# Altium project calorieScale_Project.PrjPcb
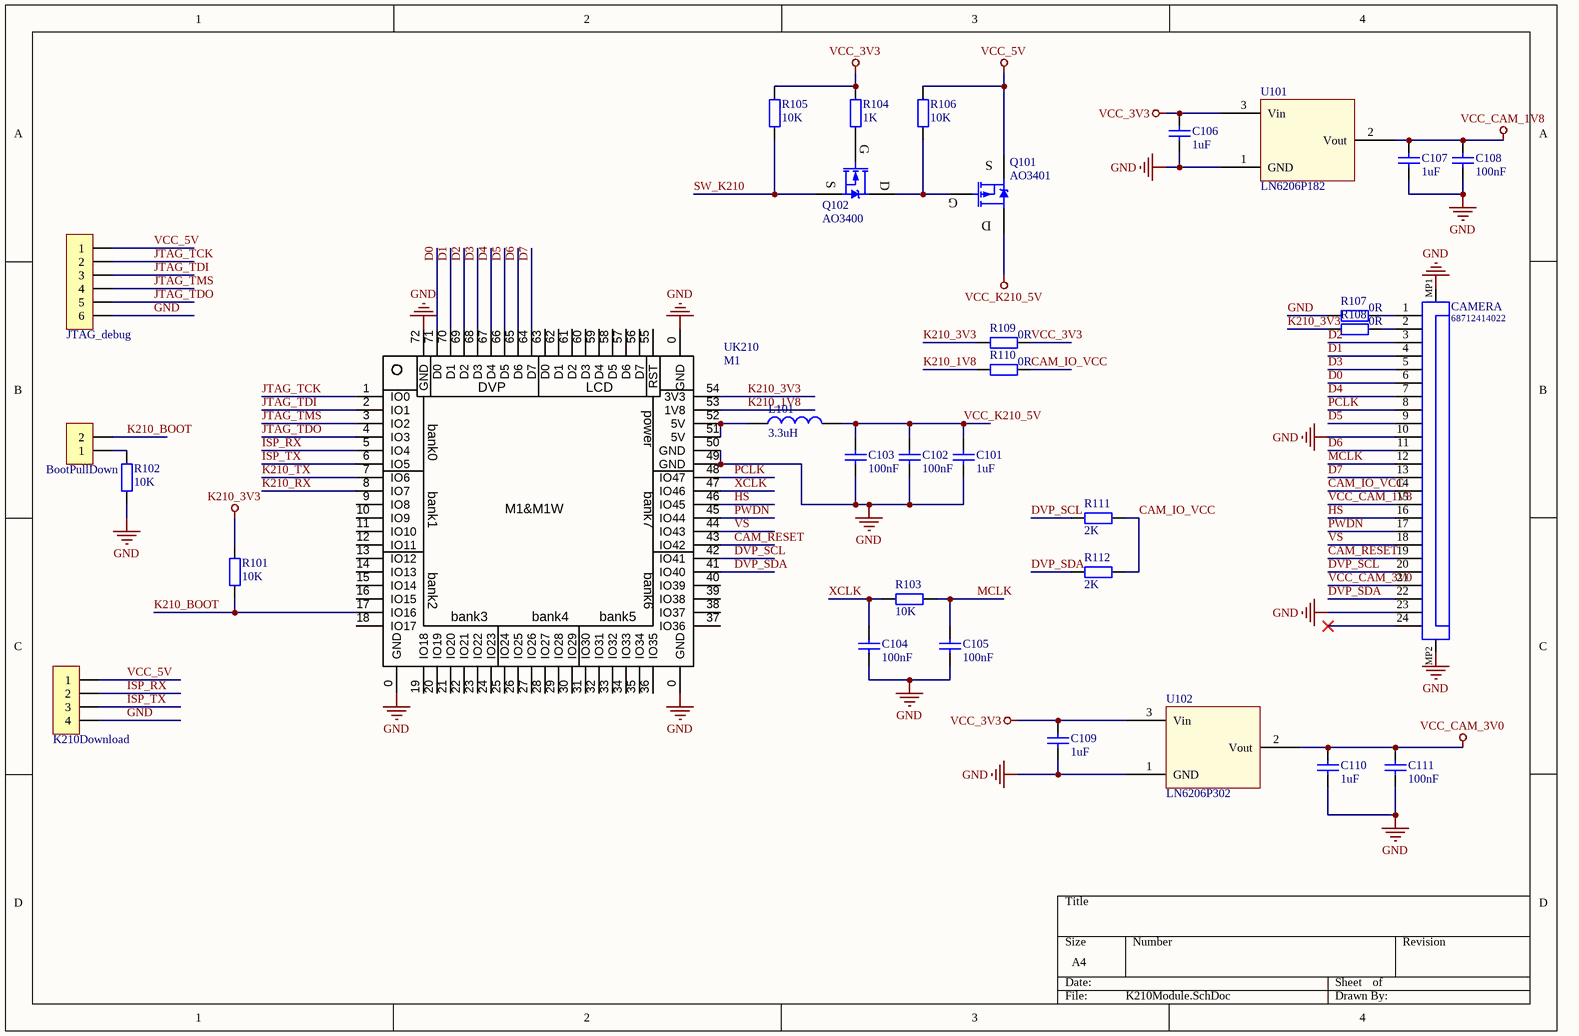
[diagram p0: K210Module.SchDoc]
3 sheets, 102 parts. Net scope: global (net labels, ports and power ports of the same name join across sheets).
Board file: calorieScale.PcbDoc
Sheets:
  K210Module.SchDoc
  Power.SchDoc
  CH573.SchDoc

## Sheet K210Module.SchDoc
size A4; SheetNumber: 1; SheetTotal: 3

### Parts
BootPullDown  HDR-1X2  [HDR2.54-LI-2P]  (value not drawn)
C101  1uF  [C0603_L]
C102  100nF  [C0603_L]
C103  100nF  [C0603_L]
C104  100nF  [C0603_L]
C105  100nF  [C0603_L]
C106  1uF  [C0603_L]
C107  1uF  [C0603_L]
C108  100nF  [C0603_L]
C109  1uF  [C0603_L]
C110  1uF  [C0603_L]
C111  100nF  [C0603_L]
CAMERA  68712414022  [68712414022]
JTAG_debug  HDR-1X6  [XH2.54-LI-6P]  (value not drawn)
K210Download  HDR-1X4  [XH2.54-LI-4P]  (value not drawn)
L101  3.3uH  [L0805]
Q101  AO3401  [SOT23-3N]
Q102  AO3400  [SOT23-3N]
R101  10K  [R0603_L]
R102  10K  [R0603_L]
R103  10K  [R0603_L]
R104  1K  [R0603_L]
R105  10K  [R0603_L]
R106  10K  [R0603_L]
R107  0R  [R0603_L]
R108  0R  [R0603_L]
R109  0R  [R0603_L]
R110  0R  [R0603_L]
R111  2K  [R0603_L]
R112  2K  [R0603_L]
U101  LN6206P182  [SOT23-3L]
U102  LN6206P302  [SOT23-3L]
UK210  M1  [M1]

### Nets
GND: C101.1 C102.1 C103.1 C104.1 C105.1 C106.1 C107.1 C108.1 C109.1 C110.1 C111.1 CAMERA.10 CAMERA.23 CAMERA.MP1 CAMERA.MP2 JTAG_debug.6 K210Download.4 R102.2 R107.2 U101.1(GND) U102.1(GND) UK210.0(GND) UK210.49(GND) UK210.50(GND) UK210.72(GND)
K210_3V3: R101.2 R108.2 R109.2 UK210.54(3V3)
VCC_3V3: C106.2 C109.2 R104.2 R105.2 R109.1 U101.3(Vin) U102.3(Vin)
VCC_5V: JTAG_debug.1 K210Download.1 Q101.2(S) R106.2
VCC_CAM_1V8: C107.2 C108.2 CAMERA.15 U101.2(Vout)
VCC_CAM_3V0: C110.2 C111.2 CAMERA.21 U102.2(Vout)
VCC_K210_5V: C101.2 C102.2 C103.2 L101.2 Q101.3(D)
CAM_IO_VCC: CAMERA.14 R110.1 R111.2 R112.2
CAM_RESET: CAMERA.19 UK210.43(IO42)
D0: CAMERA.6 UK210.71(D0)
D1: CAMERA.4 UK210.70(D1)
D2: CAMERA.3 UK210.69(D2)
D3: CAMERA.5 UK210.68(D3)
D4: CAMERA.7 UK210.67(D4)
D5: CAMERA.9 UK210.66(D5)
D6: CAMERA.11 UK210.65(D6)
D7: CAMERA.13 UK210.64(D7)
DVP_SCL: CAMERA.20 R111.1 UK210.42(IO41)
DVP_SDA: CAMERA.22 R112.1 UK210.41(IO40)
HS: CAMERA.16 UK210.46(IO45)
ISP_RX: K210Download.2 UK210.5(IO4)
ISP_TX: K210Download.3 UK210.6(IO5)
JTAG_TCK: JTAG_debug.2 UK210.1(IO0)
JTAG_TDI: JTAG_debug.3 UK210.2(IO1)
JTAG_TDO: JTAG_debug.5 UK210.4(IO3)
JTAG_TMS: JTAG_debug.4 UK210.3(IO2)
K210_1V8: R110.2 UK210.53(1V8)
K210_BOOT: BootPullDown.2 R101.1 UK210.17(IO16)
K210_RX: UK210.8(IO7)
K210_TX: UK210.7(IO6)
MCLK: C105.2 CAMERA.12 R103.2
PCLK: CAMERA.8 UK210.48(IO47)
PWDN: CAMERA.17 UK210.45(IO44)
SW_K210: Q102.2(S) R105.1
VS: CAMERA.18 UK210.44(IO43)
XCLK: C104.2 R103.1 UK210.47(IO46)
NetBootPullDown_1: BootPullDown.1 R102.1
NetCAMERA_1: CAMERA.1 R107.1
NetCAMERA_2: CAMERA.2 R108.1
NetL101_1: L101.1 UK210.51(5V) UK210.52(5V)
NetQ101_1: Q101.1(G) Q102.3(D) R106.1
NetQ102_1: Q102.1(G) R104.1

Not connected (* = marked no-connect by the designer): CAMERA 24*; UK210 9(IO8) 10(IO9) 11(IO10) 12(IO11) 13(IO12) 14(IO13) 15(IO14) 16(IO15) 18(IO17) 19(IO18) 20(IO19) 21(IO20) 22(IO21) 23(IO22) 24(IO23) 25(IO24) 26(IO25) 27(IO26) 28(IO27) 29(IO28) 30(IO29) 31(IO30) 32(IO31) 33(IO32) 34(IO33) 35(IO34) 36(IO35) 37(IO36) 38(IO37) 39(IO38) 40(IO39) 55(RST) 56(D7) 57(D6) 58(D5) 59(D4) 60(D3) 61(D2) 62(D1) 63(D0)

### Notes on the sheet
- (in symbol M1) DVP; LCD; power; bank0; bank1; bank7; M1&M1W; bank2; bank6; bank3; bank4; bank5

### Library data of the parts
BootPullDown = Header 2: 2P接插件; 联系卖家，免费查找封装: 唯一出售店铺网址https://shop463601444.taobao.com; 封装库来自淘宝卖家ID：黄晶宝石: 其他店铺购入均为盗版封装库，请立即申请退款，本店现金奖励50~200元; BOM名称: 2P接插件
C101-C111 = C: 贴片电容/MLCC电容; BOM名称: 无极性贴片电容; 联系卖家，免费查找封装: 唯一出售店铺网址https://shop463601444.taobao.com
CAMERA = CMP-1502-01558-1: SMT ZIF Connectors WR-FPC, Horizontal, Top Contact, pitch 0.5 mm, 24 pins; Manufacturer: Wurth Elektronik; Rated Current: 0.5A; Pin Number: 24; Pitch: 0.5mm; Working Voltage: 50VAC; Contact Resistance: 20mOhm; Withstanding Voltage: 250VAC; Packaging: TapeandReel; Operating Temperature: -25to85degC; Manufacturer URL: http://www.we-online.de; Mounting Technology: SMT; Package Reference: 68712414022; Orientation: Horizontal; Datasheet URL: https://katalog.we-online.de/em/datasheet/68712414022.pdf; Contact Design: TopContact; Part Number: 68712414022; Publisher: WurthElektronik
JTAG_debug = Header 6: 6P接插件; 联系卖家，免费查找封装: 唯一出售店铺网址https://shop463601444.taobao.com; 封装库来自淘宝卖家ID：黄晶宝石: 其他店铺购入均为盗版封装库，请立即申请退款，本店现金奖励50~200元; BOM名称: 6P接插件
K210Download = Header 4: 4P接插件; 联系卖家，免费查找封装: 唯一出售店铺网址https://shop463601444.taobao.com; 封装库来自淘宝卖家ID：黄晶宝石: 其他店铺购入均为盗版封装库，请立即申请退款，本店现金奖励50~200元; BOM名称: 4P接插件
L101 = L: 贴片小功率电感; BOM名称: 小功率贴片电感; 联系卖家，免费查找封装: 唯一出售店铺网址https://shop463601444.taobao.com
Q101 = AO3401: P沟道 30V/4.2A; BOM名称: 场效应管; 8元以下特价购入的买家: 还可以联系卖家远程指导AD软件使用; 参数: P沟道 30V/4.2A
Q102 = AO3400: N沟道 30V/4.2A; BOM名称: 场效应管; 8元以下特价购入的买家: 还可以联系卖家远程指导AD软件使用; 参数: N沟道 30V/4.2A
R101-R112 = R: 贴片电阻; 联系卖家，免费查找封装: 唯一出售店铺网址https://shop463601444.taobao.com; BOM名称: 贴片电阻
U101 U102 = LN6206P*

## Sheet Power.SchDoc
size A4; SheetNumber: 2; SheetTotal: 3
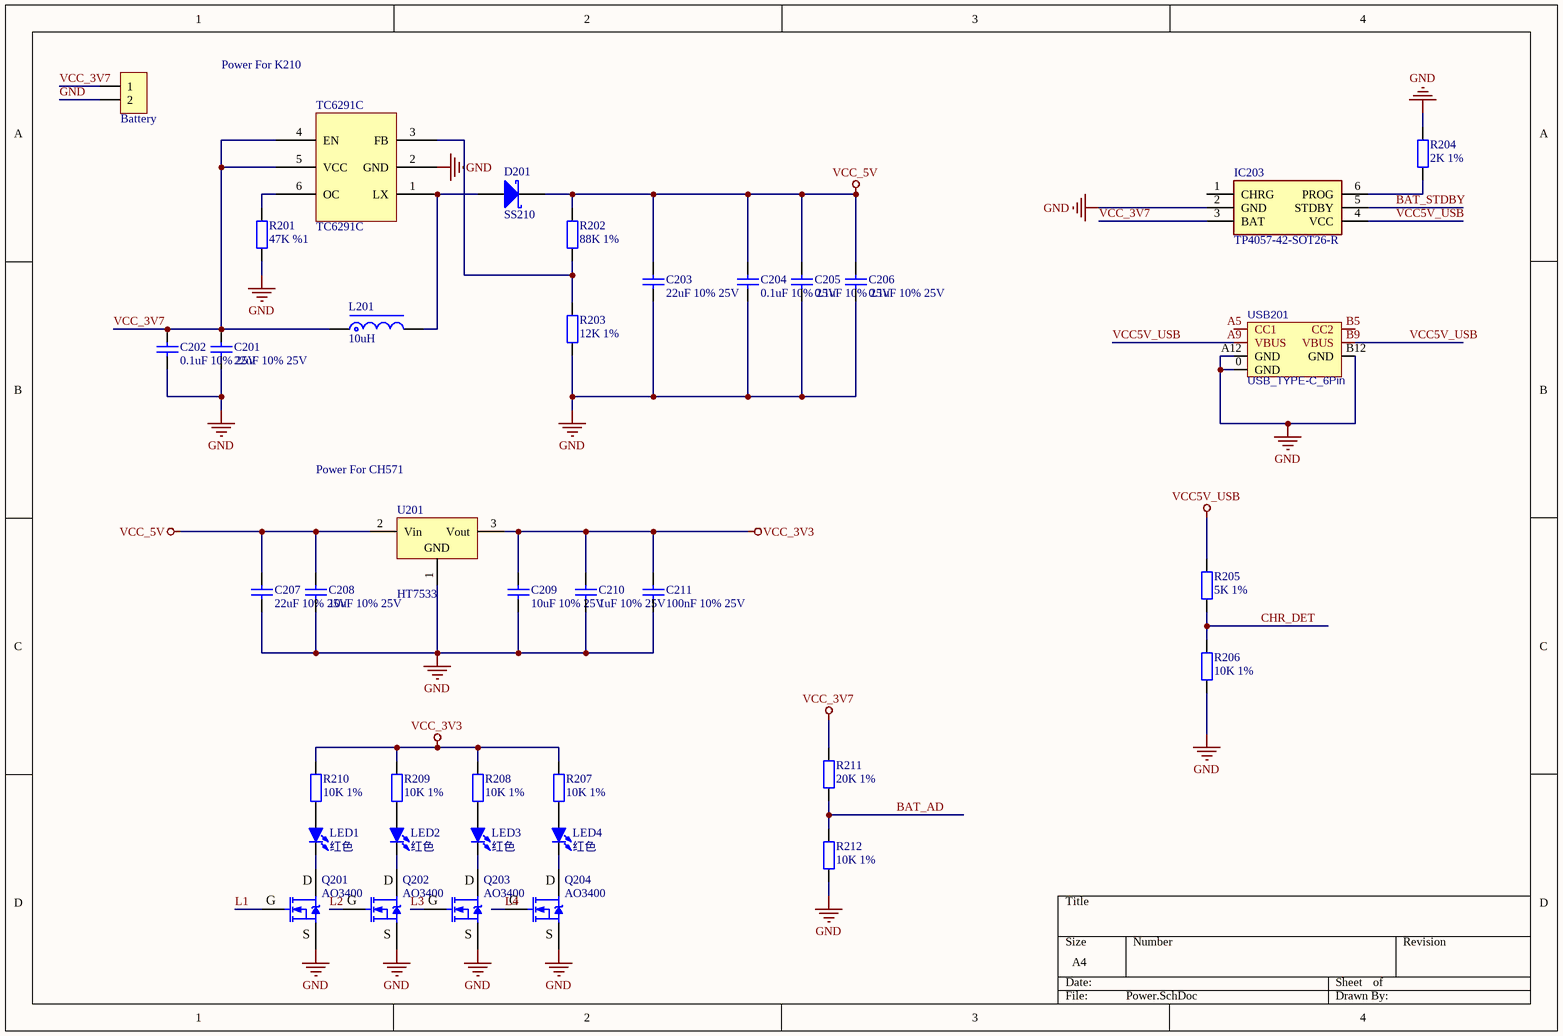
[diagram p1: Power.SchDoc]

### Parts
Battery  HDR-1X2  [ZH1.5-LI-2P]  (value not drawn)
C201  22uF 10% 25V  [C1206_L]
C202  0.1uF 10% 25V  [C0603_L]
C203  22uF 10% 25V  [C1206_L]
C204  0.1uF 10% 25V  [C0603_L]
C205  0.1uF 10% 25V  [C0603_L]
C206  0.1uF 10% 25V  [C0603_L]
C207  22uF 10% 25V  [C1206_L]
C208  10uF 10% 25V  [C0805_L]
C209  10uF 10% 25V  [C0805_L]
C210  1uF 10% 25V  [C0805_L]
C211  100nF 10% 25V  [C0805_L]
D201  SS210  [SMA]
IC203  TP4057-42-SOT26-R  [SOT95P280X125-6N]
L201  10uH  [CD52]
LED1  红色  [LED0805_G]
LED2  红色  [LED0805_G]
LED3  红色  [LED0805_G]
LED4  红色  [LED0805_G]
Q201  AO3400  [SOT23-3N]
Q202  AO3400  [SOT23-3N]
Q203  AO3400  [SOT23-3N]
Q204  AO3400  [SOT23-3N]
R201  47K %1  [R0603_L]
R202  88K 1%  [R0603_L]
R203  12K 1%  [R0603_L]
R204  2K 1%  [R0603_L]
R205  5K 1%  [R0603_L]
R206  10K 1%  [R0603_L]
R207  10K 1%  [R0603_L]
R208  10K 1%  [R0603_L]
R209  10K 1%  [R0603_L]
R210  10K 1%  [R0603_L]
R211  20K 1%  [R0603_L]
R212  10K 1%  [R0603_L]
TC6291C  TC6291C  [SOT23-6]
U201  HT7533  [SOT89_N]
USB201  USB_TYPE-C_6Pin  [USB-C-SMD_6P]

### Nets
GND: Battery.2 C201.1 C202.1 C203.1 C204.1 C205.1 C206.1 C207.1 C208.1 C209.1 C210.1 C211.1 IC203.2(GND) Q201.2(S) Q202.2(S) Q203.2(S) Q204.2(S) R201.1 R203.1 R204.2 R206.1 R212.1 TC6291C.2(GND) U201.1(GND) USB201.0(GND) USB201.A12(GND) USB201.B12(GND)
VCC5V_USB: IC203.4(VCC) R205.2 USB201.A9(VBUS) USB201.B9(VBUS)
VCC_3V3: C209.2 C210.2 C211.2 R207.2 R208.2 R209.2 R210.2 U201.3(Vout)
VCC_3V7: Battery.1 C201.2 C202.2 IC203.3(BAT) L201.1 R211.2 TC6291C.4(EN) TC6291C.5(VCC)
VCC_5V: C203.2 C204.2 C205.2 C206.2 C207.2 C208.2 D201.2(K) R202.2 U201.2(Vin)
BAT_AD: R211.1 R212.2
BAT_STDBY: IC203.5(STDBY)
CHR_DET: R205.1 R206.2
L1: Q201.1(G)
L2: Q202.1(G)
L3: Q203.1(G)
L4: Q204.1(G)
NetD201_1: D201.1(A) L201.2 TC6291C.1(LX)
NetIC203_6: IC203.6(PROG) R204.1
NetLED1_1: LED1.1(A) R210.1
NetLED1_2: LED1.2(K) Q201.3(D)
NetLED2_1: LED2.1(A) R209.1
NetLED2_2: LED2.2(K) Q202.3(D)
NetLED3_1: LED3.1(A) R208.1
NetLED3_2: LED3.2(K) Q203.3(D)
NetLED4_1: LED4.1(A) R207.1
NetLED4_2: LED4.2(K) Q204.3(D)
NetR201_2: R201.2 TC6291C.6(OC)
NetR202_1: R202.1 R203.2 TC6291C.3(FB)

Not connected (* = marked no-connect by the designer): IC203 1(CHRG); USB201 A5(CC1) B5(CC2)

### Notes on the sheet
- Power For K210
- Power For CH571

### Library data of the parts
Battery = Header 2: 2P接插件; 联系卖家，免费查找封装: 唯一出售店铺网址https://shop463601444.taobao.com; BOM名称: 2P接插件
C201-C211 = C: as C101 on sheet K210Module
D201 = SS210: 肖特基二极管; 以赠品形式获赠本封装库的买家，还可联系卖家免费指导AD软件使用: 封装库来自淘宝卖家ID：黄晶宝石; BOM名称: 肖特基二极管
IC203 = TP4057-42-SOT26-R: Integrated Circuit; Manufacturer_Name: Nanjing Extension Microelectronics; Datasheet Link: https://datasheet.lcsc.com/szlcsc/Nanjing-Extension-Microelectronics-TP4057_C12044.pdf; Height: 1.25mm; Manufacturer_Part_Number: TP4057-42-SOT26-R
L201 = L-SMD: CD系列贴片线绕功率电感; BOM名称: 功率电感; 联系卖家，免费查找封装: 唯一出售店铺网址https://shop463601444.taobao.com
LED1-LED4 = LED-SMD: 贴片LED; 封装库来自淘宝卖家ID：黄晶宝石: 其他店铺购入均为盗版封装库，请立即申请退款，本店现金奖励20~200元; BOM名称: 贴片LED
Q201-Q204 = AO3400: as Q102 on sheet K210Module; 参数: N沟道 30V/4.2A
R201-R212 = R: as R101 on sheet K210Module; BOM名称: 贴片电阻
U201 = HT7533: LDO线性稳压芯片; 封装库来自淘宝卖家ID：黄晶宝石: 其他店铺购入的买家，请立即申请退款，本店现金奖励20~1000元
USB201 = USB_TYPE-C_6Pin: USB_TYPE-C_6Pin母座; 联系卖家 免费技术支持: 封装库来自淘宝卖家ID：黄晶宝石

## Sheet CH573.SchDoc
size A3; SheetNumber: 3; SheetTotal: 3
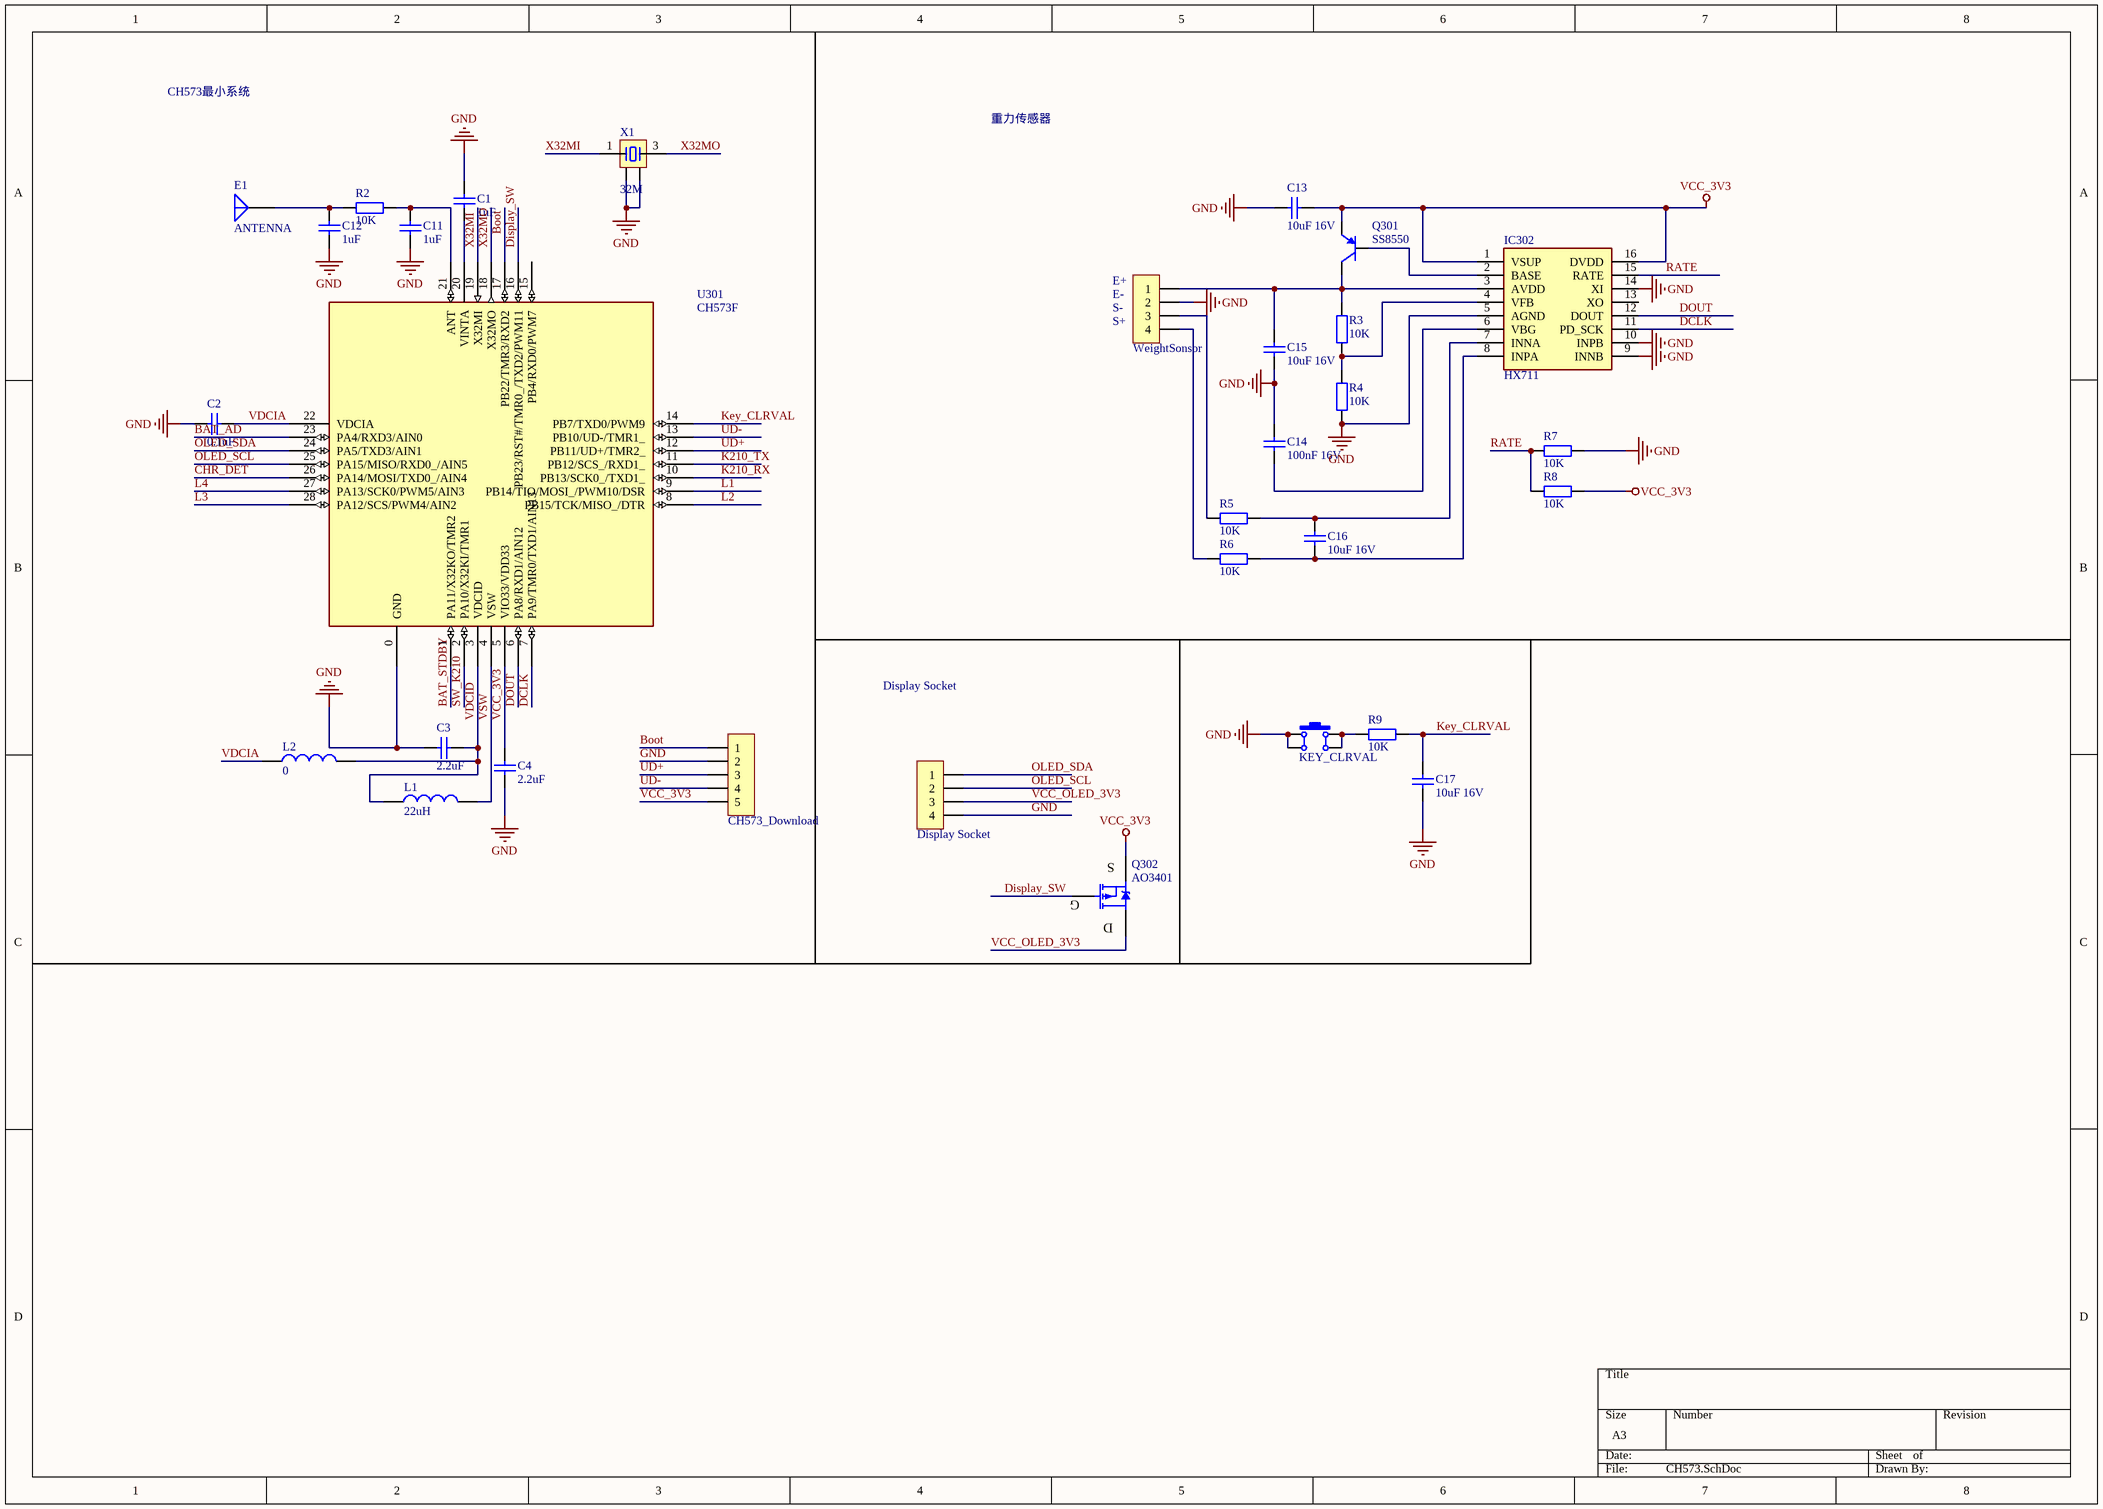
[diagram p2: CH573.SchDoc]

### Parts
C1  1uF  [C0603_L]
C2  0.1uF  [C0603_L]
C3  2.2uF  [C0603_L]
C4  2.2uF  [C0603_L]
C11  1uF  [C0201_L]
C12  1uF  [C0201_L]
C13  10uF 16V  [C0805_L]
C14  100nF 16V  [C0603_L]
C15  10uF 16V  [C0603_L]
C16  10uF 16V  [C0603_L]
C17  10uF 16V  [C0603_L]
CH573_Download  HDR-1X5  [MX1.25-L-5P]  (value not drawn)
Display_Socket  HDR-1X4  [HDR2.54-M-LI-4P]  (value not drawn)
E1  ANTENNA  [ANT-F-1-2.4G-1.6]
IC302  HX711  [SOIC127P600X160-16N]
KEY_CLRVAL  4x4x1.5  [SW SMD-4*4*1.5]  (value not drawn)
L1  22uH  [L0603]
L2  0  [L0603]
Q301  SS8550  [SOT23-3N]
Q302  AO3401  [SOT23-3N]
R2  10K  [R0201_L]
R3  10K  [R0603_L]
R4  10K  [R0603_L]
R5  10K  [R0603_L]
R6  10K  [R0603_L]
R7  10K  [R0603_L]
R8  10K  [R0603_L]
R9  10K  [R0603_L]
U301  CH573F  [QFN28_4X4]
WeightSonsor  HDR-1X4  [XH2.54-LI-4P]  (value not drawn)
X1  32M  [XTAL-3225-4P]

### Nets
GND: C1.2 C2.2 C3.2 C4.2 C11.2 C12.2 C13.1 C14.2 C15.1 C17.1 CH573_Download.2 Display_Socket.4 IC302.5(AGND) IC302.9(INNB) IC302.10(INPB) IC302.14(XI) KEY_CLRVAL.1 KEY_CLRVAL.4 R4.1 R7.1 U301.0(GND) WeightSonsor.2 X1.2 X1.4
VCC_3V3: C4.1 C13.2 CH573_Download.5 IC302.1(VSUP) IC302.16(DVDD) Q301.2(E) Q302.2(S) R8.1 U301.5(VIO33/VDD33)
BAT_AD: U301.23(PA4/RXD3/AIN0)
BAT_STDBY: U301.1(PA11/X32KO/TMR2)
Boot: CH573_Download.1 U301.17(PB22/TMR3/RXD2)
CHR_DET: U301.26(PA14/MOSI/TXD0_/AIN4)
DCLK: IC302.11(PD_SCK) U301.7(PA9/TMR0/TXD1/AIN13)
Display_SW: Q302.1(G) U301.16(PB23/RST#/TMR0_/TXD2/PWM11)
DOUT: IC302.12(DOUT) U301.6(PA8/RXD1/AIN12)
K210_RX: U301.10(PB13/SCK0_/TXD1_)
K210_TX: U301.11(PB12/SCS_/RXD1_)
Key_CLRVAL: C17.2 R9.1 U301.14(PB7/TXD0/PWM9)
L1: U301.9(PB14/TIO/MOSI_/PWM10/DSR)
L2: U301.8(PB15/TCK/MISO_/DTR)
L3: U301.28(PA12/SCS/PWM4/AIN2)
L4: U301.27(PA13/SCK0/PWM5/AIN3)
OLED_SCL: Display_Socket.2 U301.25(PA15/MISO/RXD0_/AIN5)
OLED_SDA: Display_Socket.1 U301.24(PA5/TXD3/AIN1)
RATE: IC302.15(RATE) R7.2 R8.2
SW_K210: U301.2(PA10/X32KI/TMR1)
UD+: CH573_Download.3 U301.12(PB11/UD+/TMR2_)
UD-: CH573_Download.4 U301.13(PB10/UD-/TMR1_)
VCC_OLED_3V3: Display_Socket.3 Q302.3(D)
VDCIA: C2.1 L2.1 U301.22(VDCIA)
VDCID: C3.1 L1.1 L2.2 U301.3(VDCID)
VSW: L1.2 U301.4(VSW)
X32MI: U301.19(X32MI) X1.1
X32MO: U301.18(X32MO) X1.3
NetC1_1: C1.1 U301.20(VINTA)
NetC11_1: C11.1 R2.2 U301.21(ANT)
NetC12_1: C12.1 E1.1(A) R2.1
NetC14_1: C14.1 IC302.6(VBG)
NetC15_2: C15.2 IC302.3(AVDD) Q301.3(C) R3.2 WeightSonsor.1
NetC16_1: C16.1 IC302.8(INPA) R6.1
NetC16_2: C16.2 IC302.7(INNA) R5.1
NetIC302_2: IC302.2(BASE) Q301.1(B)
NetIC302_4: IC302.4(VFB) R3.1 R4.2
NetKEY_CLRVAL_2: KEY_CLRVAL.2 KEY_CLRVAL.3 R9.2
NetR5_2: R5.2 WeightSonsor.3
NetR6_2: R6.2 WeightSonsor.4

Not connected (* = marked no-connect by the designer): IC302 13(XO); U301 15(PB4/RXD0/PWM7)

### Notes on the sheet
- CH573最小系统
- 重力传感器
- (near WeightSonsor) E+
- (near WeightSonsor) E-
- (near WeightSonsor) S-
- (near WeightSonsor) S+
- Display Socket

### Library data of the parts
C1-C4 C11-C17 = C: as C101 on sheet K210Module
CH573_Download = Header 5: 5P连接器; 联系卖家 免费技术支持: 封装库来自淘宝卖家ID：黄晶宝石; BOM名称: 5P连接器
Display_Socket WeightSonsor = Header 4: as K210Download on sheet K210Module; BOM名称: 4P接插件
E1 = ANTENNA: Generic Antenna
IC302 = HX711: Integrated Circuit; Manufacturer_Name: AVIA Semiconductor; Datasheet Link: https://cdn.sparkfun.com/datasheets/Sensors/ForceFlex/hx711_english.pdf; Height: 1.6mm; Manufacturer_Part_Number: HX711
KEY_CLRVAL = SW SMD-4x4: 贴片4x4轻触开关; 联系卖家，免费查找封装: 唯一出售店铺网址https://shop463601444.taobao.com; 封装库来自淘宝卖家ID：黄晶宝石: 其他店铺购入的，请立即申请退款，本店现金奖励20~500元; BOM名称: 贴片4x4轻触开关
L1 L2 = L: as L101 on sheet K210Module
Q301 = 8550-SMD: 高频放大-PNP型; 参数: 40V 1.5A 1W 100MHZ; 8元以下特价购入的买家: 还可以联系卖家远程指导AD软件使用; BOM名称: 高频放大-PNP型
Q302 = AO3401: as Q101 on sheet K210Module; 参数: P沟道 30V/4.2A
R2-R9 = R: as R101 on sheet K210Module; BOM名称: 贴片电阻
U301 = CH573F: RISC-V MCU with BLE/USB/ADC/SPI/4*UART
X1 = XTAL-4P: 4脚无源晶振(谐振器）; 联系卖家，免费查找封装: 唯一出售店铺网址https://shop463601444.taobao.com; BOM名称: 4脚无源晶振(谐振器）

## Nets that join several sheets
GND: K210Module (25 pins), Power (27 pins), CH573 (24 pins)
VCC_3V3: K210Module (7 pins), Power (8 pins), CH573 (9 pins)
VCC_5V: K210Module (JTAG_debug.1 K210Download.1 Q101.2 R106.2), Power (9 pins)
BAT_AD: Power (R211.1 R212.2), CH573 (U301.23)
BAT_STDBY: Power (IC203.5), CH573 (U301.1)
CHR_DET: Power (R205.1 R206.2), CH573 (U301.26)
K210_RX: K210Module (UK210.8), CH573 (U301.10)
K210_TX: K210Module (UK210.7), CH573 (U301.11)
L1: Power (Q201.1), CH573 (U301.9)
L2: Power (Q202.1), CH573 (U301.8)
L3: Power (Q203.1), CH573 (U301.28)
L4: Power (Q204.1), CH573 (U301.27)
SW_K210: K210Module (Q102.2 R105.1), CH573 (U301.2)